# Altium schematic sheet CPU.3.SchDoc
size C
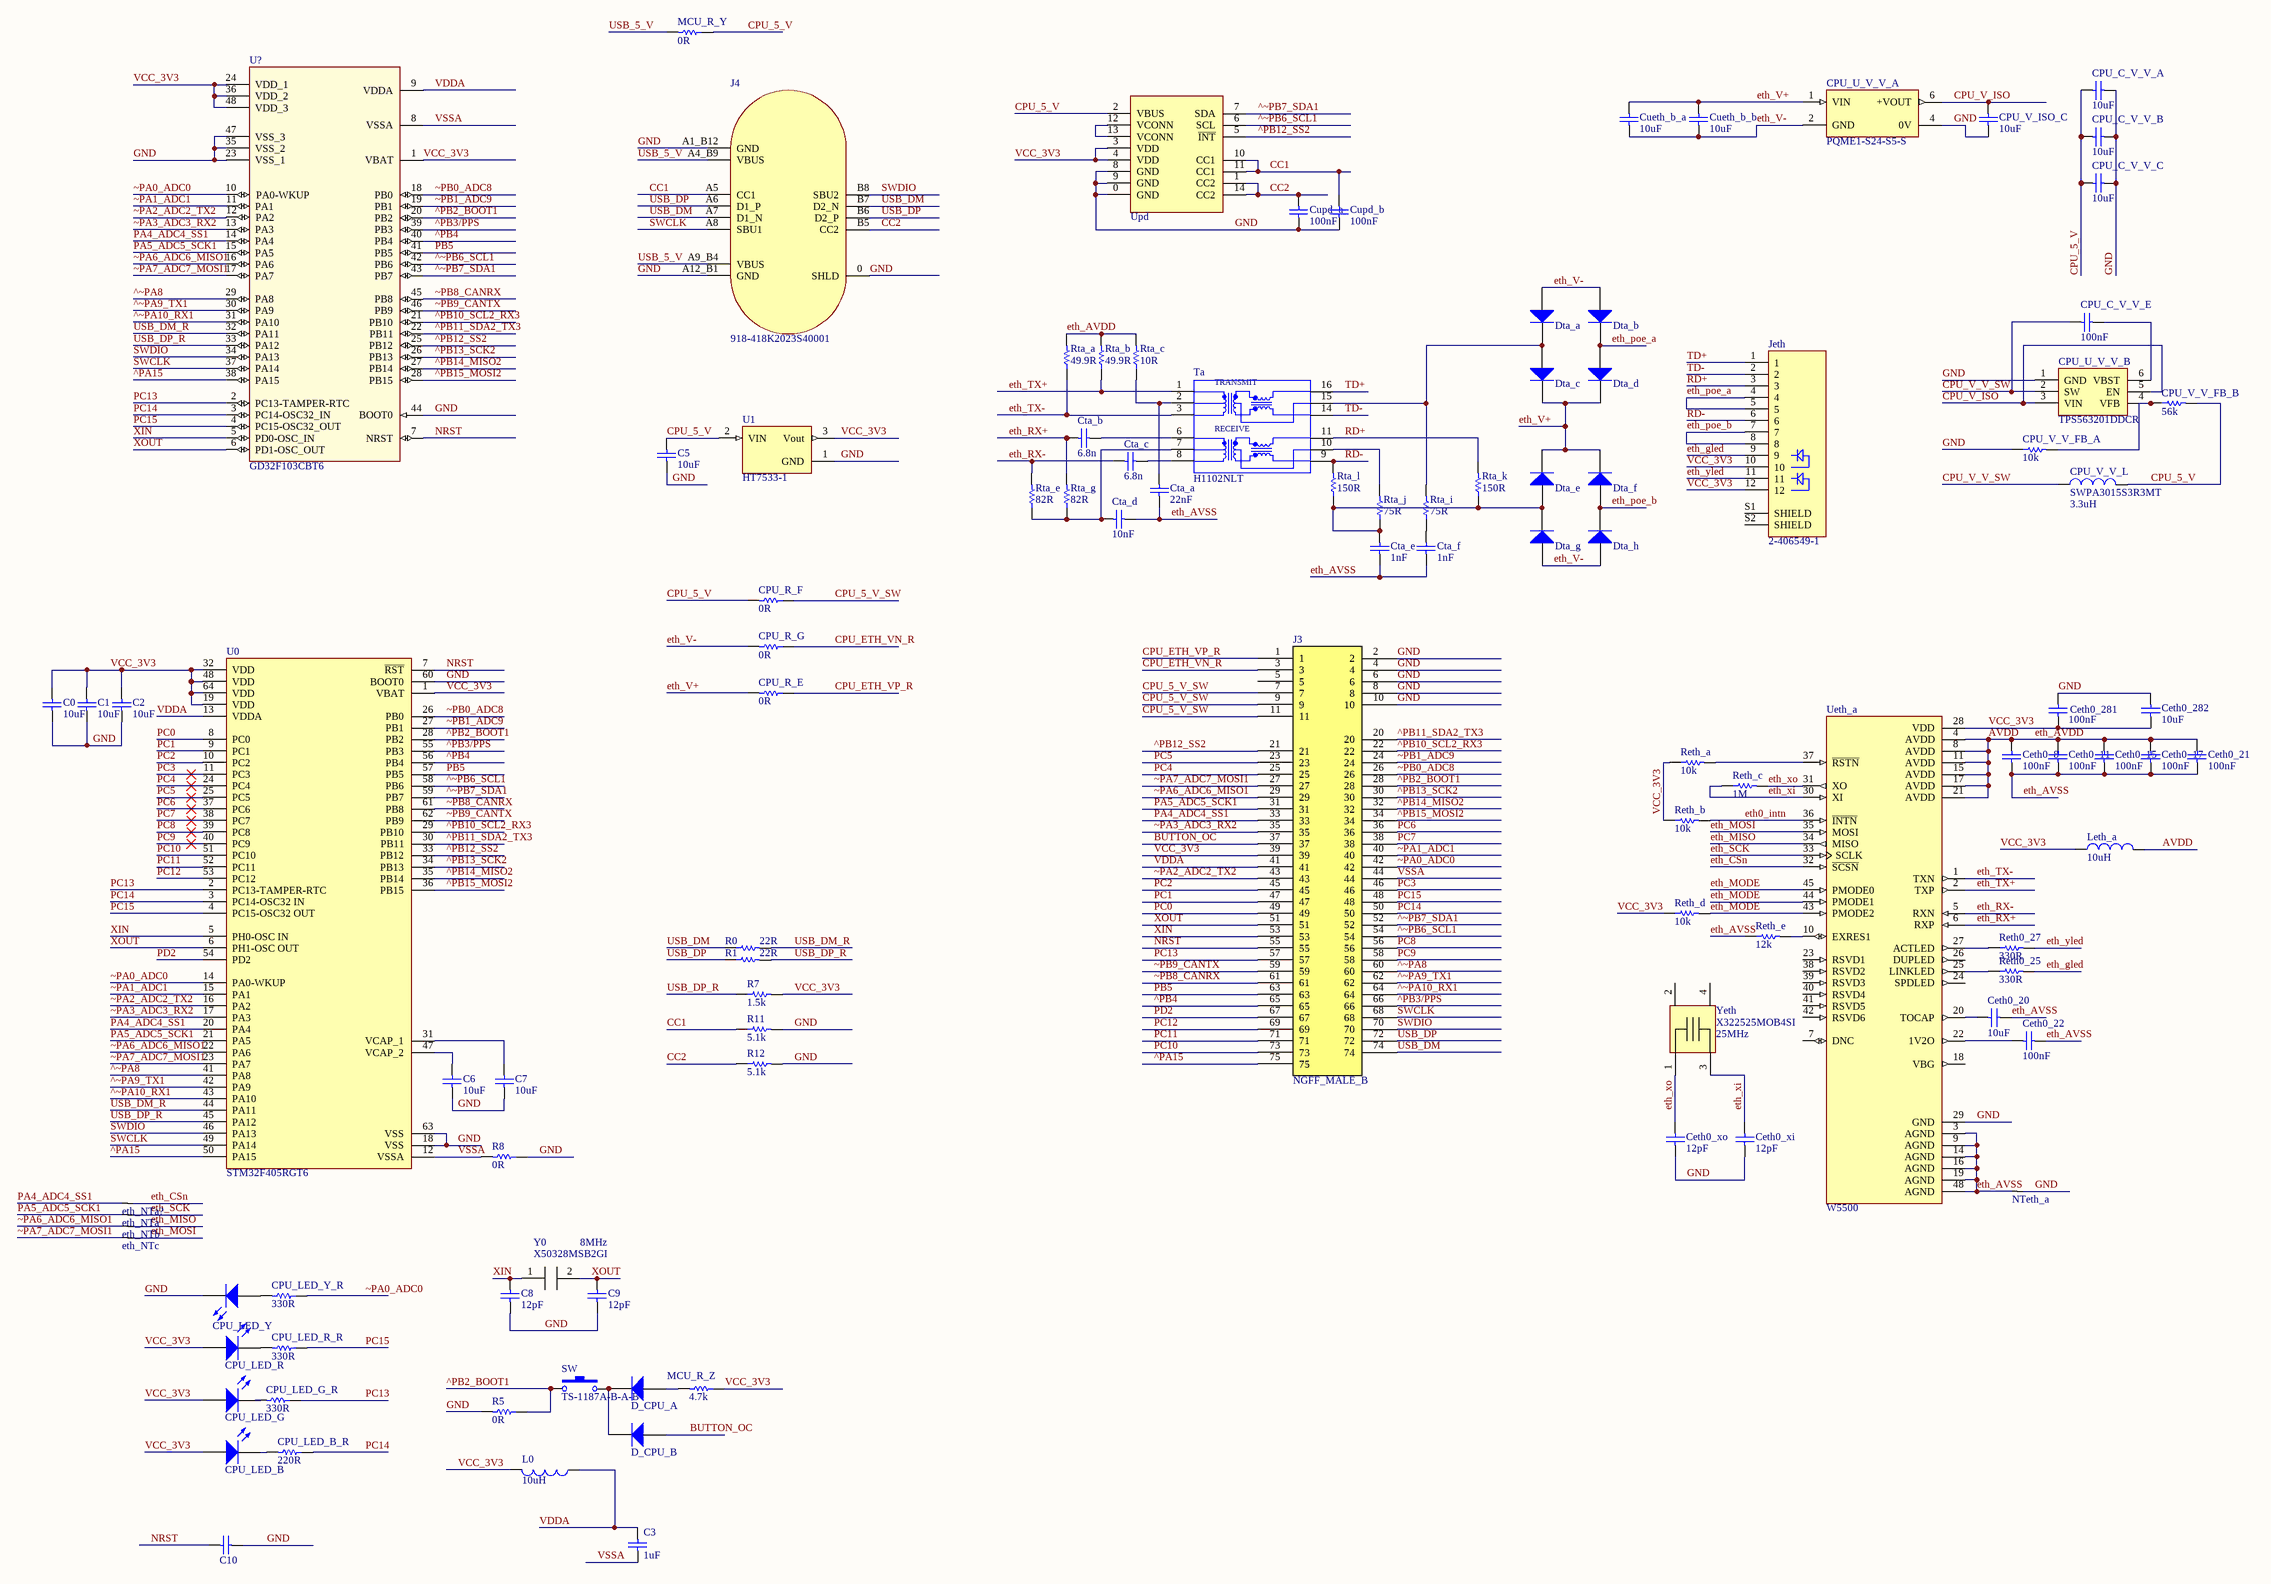
[diagram p0: CPU.3.SchDoc]

## Parts
C0  value 10uF  [C_0402]  (hidden comment: CL05A106MQ5NUNC)
C1  value 10uF  [C_0402]  (hidden comment: CL05A106MQ5NUNC)
C2  value 10uF  [C_0402]  (hidden comment: CL05A106MQ5NUNC)
C3  value 1uF  [C_0402]  (hidden comment: CL05A105KA5NQNC)
C5  value 10uF  [C_0805]  (hidden comment: CL21A106KAYNNNE)
C6  value 10uF  [C_0402]  (hidden comment: CL05A106MQ5NUNC)
C7  value 10uF  [C_0402]  (hidden comment: CL05A106MQ5NUNC)
C8  value 12pF  [C_0402]  (hidden comment: 0402CG120J500NT)
C9  value 12pF  [C_0402]  (hidden comment: 0402CG120J500NT)
C10  0402CG101J500NT  [C_0402]  (value not drawn)
Ceth0_8  value 100nF  [C_0402]  (hidden comment: CL05B104KO5NNNC)
Ceth0_11  value 100nF  [C_0402]  (hidden comment: CL05B104KO5NNNC)
Ceth0_15  value 100nF  [C_0402]  (hidden comment: CL05B104KO5NNNC)
Ceth0_17  value 100nF  [C_0402]  (hidden comment: CL05B104KO5NNNC)
Ceth0_20  value 10uF  [C_0402]  (hidden comment: CL05A106MQ5NUNC)
Ceth0_21  value 100nF  [C_0402]  (hidden comment: CL05B104KO5NNNC)
Ceth0_22  value 100nF  [C_0402]  (hidden comment: CL05B104KO5NNNC)
Ceth0_281  value 100nF  [C_0402]  (hidden comment: CL05B104KO5NNNC)
Ceth0_282  value 10uF  [C_0402]  (hidden comment: CL05A106MQ5NUNC)
Ceth0_xi  value 12pF  [C_0402]  (hidden comment: 0402CG120J500NT)
Ceth0_xo  value 12pF  [C_0402]  (hidden comment: 0402CG120J500NT)
CPU_C_V_V_A  value 10uF  [C_0402]  (hidden comment: CL05A106MQ5NUNC)
CPU_C_V_V_B  value 10uF  [C_0402]  (hidden comment: CL05A106MQ5NUNC)
CPU_C_V_V_C  value 10uF  [C_0402]  (hidden comment: CL05A106MQ5NUNC)
CPU_C_V_V_E  value 100nF  [C_0402]  (hidden comment: CL05B104KO5NNNC)
CPU_LED_B  19-217/BHC-ZL1M2RY/3T  [D_0603]  (value not drawn)
CPU_LED_B_R  value 220R  [R_0402]  (hidden comment: 0402WGF2200TCE)
CPU_LED_G  19-217/GHC-YR1S2/3T  [D_0603]  (value not drawn)
CPU_LED_G_R  value 330R  [R_0402]  (hidden comment: 0402WGF3300TCE)
CPU_LED_R  KT-0603R  [D_0603]  (value not drawn)
CPU_LED_R_R  value 330R  [R_0402]  (hidden comment: 0402WGF3300TCE)
CPU_LED_Y  19-21UYC/S530-A4/TR8  [D_0603]  (value not drawn)
CPU_LED_Y_R  value 330R  [R_0402]  (hidden comment: 0402WGF3300TCE)
CPU_R_E  value 0R  [R_0402]  (hidden comment: 0402WGF0000TCE)
CPU_R_F  value 0R  [R_0402]  (hidden comment: 0402WGF0000TCE)
CPU_R_G  value 0R  [R_0402]  (hidden comment: 0402WGF0000TCE)
CPU_U_V_V_A  PQME1-S24-S5-S  [PQME1]
CPU_U_V_V_B  TPS563201DDCR  [SOT-23-6]
CPU_V_ISO_C  value 10uF  [C_0805]  (hidden comment: CL21A106KAYNNNE)
CPU_V_V_FB_A  value 10k  [R_0402]  (hidden comment: 0402WGF1002TCE)
CPU_V_V_FB_B  value 56k  [R_0402]  (hidden comment: 0402WGF5602TCE)
CPU_V_V_L  SWPA3015S3R3MT  value 3.3uH  [swpa301]
Cta_a  value 22nF  [C_0402]  (hidden comment: 0402B223K500NT)
Cta_b  value 6.8n  [C_0402]  (hidden comment: 0402B682K500NT)
Cta_c  value 6.8n  [C_0402]  (hidden comment: 0402B682K500NT)
Cta_d  value 10nF  [C_0402]  (hidden comment: CL05B103KB5NNNC)
Cta_e  value 1nF  [C_1206]  (hidden comment: 1206B102K202NT)
Cta_f  value 1nF  [C_1206]  (hidden comment: 1206B102K202NT)
Cueth_b_a  value 10uF  [C_0805]  (hidden comment: CL21A106KAYNNNE)
Cueth_b_b  value 10uF  [C_0805]  (hidden comment: CL21A106KAYNNNE)
Cupd_a  value 100nF  [C_0402]  (hidden comment: CL05B104KO5NNNC)
Cupd_b  value 100nF  [C_0402]  (hidden comment: CL05B104KO5NNNC)
D_CPU_A  1N4148WS  [SOD-323]  (value not drawn)
D_CPU_B  1N4148WS  [SOD-323]  (value not drawn)
Dta_a  1N4148WS  [SOD-323]  (value not drawn)
Dta_b  1N4148WS  [SOD-323]  (value not drawn)
Dta_c  1N4148WS  [SOD-323]  (value not drawn)
Dta_d  1N4148WS  [SOD-323]  (value not drawn)
Dta_e  1N4148WS  [SOD-323]  (value not drawn)
Dta_f  1N4148WS  [SOD-323]  (value not drawn)
Dta_g  1N4148WS  [SOD-323]  (value not drawn)
Dta_h  1N4148WS  [SOD-323]  (value not drawn)
eth_NTa  0  [NET_TIE]  (value not drawn)
eth_NTa?  0  [NET_TIE]  (value not drawn)
eth_NTb  0  [NET_TIE]  (value not drawn)
eth_NTc  0  [NET_TIE]  (value not drawn)
J3  NGFF_MALE_B  [NGFF_MALE_B]
J4  918-418K2023S40001  [DX07S016JA1R1500]
Jeth  2-406549-1  [TE_2-406549-1]
L0  value 10uH  [L_0603]  (hidden comment: SDFL1608S100KTF)
Leth_a  value 10uH  [L_0603]  (hidden comment: SDFL1608S100KTF)
MCU_R_Y  value 0R  [R_0402]  (hidden comment: 0402WGF0000TCE)
MCU_R_Z  value 4.7k  [R_0402]  (hidden comment: 0402WGF4701TCE)
NTeth_a  0  [NET_TIE]  (value not drawn)
R0  value 22R  [R_0402]  (hidden comment: 0402WGF220JTCE)
R1  value 22R  [R_0402]  (hidden comment: 0402WGF220JTCE)
R5  value 0R  [R_0402]  (hidden comment: 0402WGF0000TCE)
R7  value 1.5k  [R_0402]  (hidden comment: 0402WGF1501TCE)
R8  value 0R  [R_0402]  (hidden comment: 0402WGF0000TCE)
R11  value 5.1k  [R_0402]  (hidden comment: 0402WGF5101TCE)
R12  value 5.1k  [R_0402]  (hidden comment: 0402WGF5101TCE)
Reth0_25  value 330R  [R_0402]  (hidden comment: 0402WGF3300TCE)
Reth0_27  value 330R  [R_0402]  (hidden comment: 0402WGF3300TCE)
Reth_a  value 10k  [R_0402]  (hidden comment: 0402WGF1002TCE)
Reth_b  value 10k  [R_0402]  (hidden comment: 0402WGF1002TCE)
Reth_c  value 1M  [R_0402]  (hidden comment: 0402WGF1004TCE)
Reth_d  value 10k  [R_0402]  (hidden comment: 0402WGF1002TCE)
Reth_e  value 12k  [R_0402]  (hidden comment: 0402WGF1202TCE)
Rta_a  value 49.9R  [R_0402]  (hidden comment: 0402WGF499JTCE)
Rta_b  value 49.9R  [R_0402]  (hidden comment: 0402WGF499JTCE)
Rta_c  value 10R  [R_0402]  (hidden comment: 0402WGF100JTCE)
Rta_e  value 82R  [R_0603]  (hidden comment: 0603WAF820JT5E)
Rta_g  value 82R  [R_0603]  (hidden comment: 0603WAF820JT5E)
Rta_i  value 75R  [R_0402]  (hidden comment: 0402WGF750JTCE)
Rta_j  value 75R  [R_0402]  (hidden comment: 0402WGF750JTCE)
Rta_k  value 150R  [R_0402]  (hidden comment: 0402WGF1500TCE)
Rta_l  value 150R  [R_0402]  (hidden comment: 0402WGF1500TCE)
SW  TS-1187A-B-A-B  [TS-1187A-C-C-B]
Ta  H1102NLT  [XFMR_H1102NLT]
U0  STM32F405RGT6  [QFP-64-P0.5MM]
U1  HT7533-1  [SOT-223-3]
U?  GD32F103CBT6  [QFP-48-P0.5MM]
Ueth_a  W5500  [QFP-48-P0.5MM]
Upd  FUSB302BMPX  [QFN-14-P0.5MM]  (value not drawn)
Y0  X50328MSB2GI  value 8MHz  [YSX530GA]
Yeth  X322525MOB4SI  value 25MHz  [X322512MSB4SI]

## Nets
^PA15: J3.75 U0.50(PA15) U?.38(PA15)
^PB2_BOOT1: J3.28 R5.1 SW.1 U0.28(PB2) U?.20(PB2)
^PB3/PPS: J3.66 U0.55(PB3) U?.39(PB3)
^PB4: J3.65 U0.56(PB4) U?.40(PB4)
^PB10_SCL2_RX3: J3.22 U0.29(PB10) U?.21(PB10)
^PB11_SDA2_TX3: J3.20 U0.30(PB11) U?.22(PB11)
^PB12_SS2: J3.21 U0.33(PB12) U?.25(PB12) Upd.5(~{INT})
^PB13_SCK2: J3.30 U0.34(PB13) U?.26(PB13)
^PB14_MISO2: J3.32 U0.35(PB14) U?.27(PB14)
^PB15_MOSI2: J3.34 U0.36(PB15) U?.28(PB15)
^~PA8: J3.60 U0.41(PA8) U?.29(PA8)
^~PA9_TX1: J3.62 U0.42(PA9) U?.30(PA9)
^~PA10_RX1: J3.64 U0.43(PA10) U?.31(PA10)
^~PB6_SCL1: J3.54 U0.58(PB6) U?.42(PB6) Upd.6(SCL)
^~PB7_SDA1: J3.52 U0.59(PB7) U?.43(PB7) Upd.7(SDA)
AVDD: Ceth0_8.2 Ceth0_11.2 Ceth0_15.2 Ceth0_17.2 Ceth0_21.2 Leth_a.2 Rta_a.2 Rta_b.2 Rta_c.2 Ueth_a.4(AVDD) Ueth_a.8(AVDD) Ueth_a.11(AVDD) Ueth_a.15(AVDD) Ueth_a.17(AVDD) Ueth_a.21(AVDD)  [also labelled eth_AVDD]
BUTTON_OC: D_CPU_B.2(A) J3.37
CC1: Cupd_b.1 J4.A5(CC1) R11.1 Upd.10(CC1) Upd.11(CC1)
CC2: Cupd_a.1 J4.B5(CC2) R12.1 Upd.1(CC2) Upd.14(CC2)
CPU_5_V: C5.2 CPU_C_V_V_A.1 CPU_C_V_V_B.1 CPU_C_V_V_C.1 CPU_R_F.2 CPU_V_V_FB_B.2 CPU_V_V_L.2 MCU_R_Y.1 U1.2(VIN) Upd.2(VBUS)
CPU_5_V_SW: CPU_R_F.1 J3.7 J3.9 J3.11
CPU_ETH_VN_R: CPU_R_G.1 J3.3
CPU_ETH_VP_R: CPU_R_E.1 J3.1
CPU_V_ISO: CPU_U_V_V_A.6(+VOUT) CPU_U_V_V_B.3(VIN) CPU_U_V_V_B.5(EN) CPU_V_ISO_C.2
CPU_V_V_SW: CPU_C_V_V_E.1 CPU_U_V_V_B.2(SW) CPU_V_V_L.1
eth0_intn: Reth_b.2 Ueth_a.36(~{INTN})
eth_AVSS: Ceth0_8.1 Ceth0_11.1 Ceth0_15.1 Ceth0_17.1 Ceth0_20.2 Ceth0_21.1 Ceth0_22.1 Cta_a.1 Cta_d.2 Cta_e.1 Cta_f.1 NTeth_a.1 Reth_e.1 Ueth_a.3(AGND) Ueth_a.9(AGND) Ueth_a.14(AGND) Ueth_a.16(AGND) Ueth_a.19(AGND) Ueth_a.48(AGND)
eth_CSn: eth_NTa?.2 Ueth_a.32(~{SCSN})
eth_gled: Jeth.9 Reth0_25.2
eth_MISO: eth_NTb.2 Ueth_a.34(MISO)
eth_MODE: Reth_d.2 Ueth_a.43(PMODE2) Ueth_a.44(PMODE1) Ueth_a.45(PMODE0)
eth_MOSI: eth_NTc.2 Ueth_a.35(MOSI)
eth_poe_a: Dta_b.1(K) Dta_d.2(A) Jeth.4 Jeth.5
eth_poe_b: Dta_f.2(A) Dta_h.1(K) Jeth.7 Jeth.8
eth_RX+: Cta_b.1 Rta_g.2 Ueth_a.6(RXP)
eth_RX-: Cta_c.1 Rta_e.2 Ueth_a.5(RXN)
eth_SCK: eth_NTa.2 Ueth_a.33(SCLK)
eth_TX+: Rta_b.1 Ta.1 Ueth_a.2(TXP)
eth_TX-: Rta_a.1 Ta.3 Ueth_a.1(TXN)
eth_V+: CPU_R_E.2 CPU_U_V_V_A.1(VIN) Cueth_b_a.2 Cueth_b_b.2 Dta_c.1(K) Dta_d.1(K) Dta_e.1(K) Dta_f.1(K)
eth_V-: CPU_R_G.2 CPU_U_V_V_A.2(GND) Cueth_b_a.1 Cueth_b_b.1 Dta_a.2(A) Dta_b.2(A) Dta_g.2(A) Dta_h.2(A)
eth_xi: Ceth0_xi.2 Reth_c.1 Ueth_a.30(XI) Yeth.3
eth_xo: Ceth0_xo.2 Reth_c.2 Ueth_a.31(XO) Yeth.1
eth_yled: Jeth.11 Reth0_27.2
GND: C0.1 C1.1 C2.1 C5.1 C6.1 C7.1 C8.1 C9.1 C10.1 Ceth0_281.1 Ceth0_282.2 Ceth0_xi.1 Ceth0_xo.1 CPU_C_V_V_A.2 CPU_C_V_V_B.2 CPU_C_V_V_C.2 CPU_LED_Y.1(K) CPU_U_V_V_A.4(0V) CPU_U_V_V_B.1(GND) CPU_V_ISO_C.1 CPU_V_V_FB_A.1 Cupd_a.2 Cupd_b.2 J3.2 J3.4 J3.6 J3.8 J3.10 J4.0(SHLD) J4.A1_B12(GND) J4.A12_B1(GND) NTeth_a.2 R5.2 R8.1 R11.2 R12.2 U0.18(VSS) U0.60(BOOT0) U0.63(VSS) U1.1(GND) U?.23(VSS_1) U?.35(VSS_2) U?.44(BOOT0) U?.47(VSS_3) Ueth_a.29(GND) Upd.0(GND) Upd.8(GND) Upd.9(GND)
NRST: C10.2 J3.55 U0.7(~{RST}) U?.7(NRST)
PA4_ADC4_SS1: eth_NTa?.1 J3.33 U0.20(PA4) U?.14(PA4)
PA5_ADC5_SCK1: eth_NTa.1 J3.31 U0.21(PA5) U?.15(PA5)
PB5: J3.63 U0.57(PB5) U?.41(PB5)
PC0: J3.49 U0.8(PC0)
PC1: J3.47 U0.9(PC1)
PC2: J3.45 U0.10(PC2)
PC3: J3.46 U0.11(PC3)
PC4: J3.25 U0.24(PC4)
PC5: J3.23 U0.25(PC5)
PC6: J3.36 U0.37(PC6)
PC7: J3.38 U0.38(PC7)
PC8: J3.56 U0.39(PC8)
PC9: J3.58 U0.40(PC9)
PC10: J3.73 U0.51(PC10)
PC11: J3.71 U0.52(PC11)
PC12: J3.69 U0.53(PC12)
PC13: CPU_LED_G_R.1 J3.57 U0.2(PC13-TAMPER-RTC) U?.2(PC13-TAMPER-RTC)
PC14: CPU_LED_B_R.1 J3.50 U0.3(PC14-OSC32_IN) U?.3(PC14-OSC32_IN)
PC15: CPU_LED_R_R.1 J3.48 U0.4(PC15-OSC32_OUT) U?.4(PC15-OSC32_OUT)
PD2: J3.67 U0.54(PD2)
RD+: Jeth.3 Rta_k.2 Ta.11
RD-: Jeth.6 Rta_l.2 Ta.9
SWCLK: J3.68 J4.A8(SBU1) U0.49(PA14) U?.37(PA14)
SWDIO: J3.70 J4.B8(SBU2) U0.46(PA13) U?.34(PA13)
TD+: Jeth.1 Ta.16
TD-: Jeth.2 Ta.14
USB_5_V: J4.A4_B9(VBUS) J4.A9_B4(VBUS) MCU_R_Y.2
USB_DM: J3.74 J4.A7(D1_N) J4.B7(D2_N) R0.1
USB_DM_R: R0.2 U0.44(PA11) U?.32(PA11)
USB_DP: J3.72 J4.A6(D1_P) J4.B6(D2_P) R1.1
USB_DP_R: R1.2 R7.1 U0.45(PA12) U?.33(PA12)
VCC_3V3: C0.2 C1.2 C2.2 Ceth0_281.2 Ceth0_282.1 CPU_LED_B.2(A) CPU_LED_G.2(A) CPU_LED_R.2(A) J3.39 Jeth.10 Jeth.12 L0.2 Leth_a.1 MCU_R_Z.1 R7.2 Reth_a.1 Reth_b.1 Reth_d.1 U0.1(VBAT) U0.19(VDD) U0.32(VDD) U0.48(VDD) U0.64(VDD) U1.3(Vout) U?.1(VBAT) U?.24(VDD_1) U?.36(VDD_2) U?.48(VDD_3) Ueth_a.28(VDD) Upd.3(VDD) Upd.4(VDD)
VDDA: C3.2 J3.41 L0.1 U0.13(VDDA) U?.9(VDDA)
VSSA: C3.1 J3.44 R8.2 U0.12(VSSA) U?.8(VSSA)
XIN: C8.2 J3.53 U0.5(PH0-OSC_IN) U?.5(PD0-OSC_IN) Y0.1
XOUT: C9.2 J3.51 U0.6(PH1-OSC_OUT) U?.6(PD1-OSC_OUT) Y0.2
~PA0_ADC0: CPU_LED_Y_R.1 J3.42 U0.14(PA0-WKUP) U?.10(PA0-WKUP)
~PA1_ADC1: J3.40 U0.15(PA1) U?.11(PA1)
~PA2_ADC2_TX2: J3.43 U0.16(PA2) U?.12(PA2)
~PA3_ADC3_RX2: J3.35 U0.17(PA3) U?.13(PA3)
~PA6_ADC6_MISO1: eth_NTb.1 J3.29 U0.22(PA6) U?.16(PA6)
~PA7_ADC7_MOSI1: eth_NTc.1 J3.27 U0.23(PA7) U?.17(PA7)
~PB0_ADC8: J3.26 U0.26(PB0) U?.18(PB0)
~PB1_ADC9: J3.24 U0.27(PB1) U?.19(PB1)
~PB8_CANRX: J3.61 U0.61(PB8) U?.45(PB8)
~PB9_CANTX: J3.59 U0.62(PB9) U?.46(PB9)
NetC6_2: C6.2 U0.47(VCAP_2)
NetC7_2: C7.2 U0.31(VCAP_1)
NetCeth0_20_1: Ceth0_20.1 Ueth_a.20(TOCAP)
NetCeth0_22_2: Ceth0_22.2 Ueth_a.22(1V2O)
NetCPU_C_V_V_E_2: CPU_C_V_V_E.2 CPU_U_V_V_B.6(VBST)
NetCPU_LED_B_1: CPU_LED_B.1(K) CPU_LED_B_R.2
NetCPU_LED_G_1: CPU_LED_G.1(K) CPU_LED_G_R.2
NetCPU_LED_R_1: CPU_LED_R.1(K) CPU_LED_R_R.2
NetCPU_LED_Y_2: CPU_LED_Y.2(A) CPU_LED_Y_R.2
NetCPU_U_V_V_B_4: CPU_U_V_V_B.4(VFB) CPU_V_V_FB_A.2 CPU_V_V_FB_B.1
NetCta_a_2: Cta_a.2 Rta_c.1 Ta.2
NetCta_b_2: Cta_b.2 Ta.6
NetCta_c_2: Cta_c.2 Ta.8
NetCta_d_1: Cta_d.1 Rta_e.1 Rta_g.1 Ta.7
NetCta_e_2: Cta_e.2 Dta_e.2(A) Dta_g.1(K) Rta_j.1 Rta_k.1 Rta_l.1
NetCta_f_2: Cta_f.2 Rta_i.1
NetD_CPU_A_1: D_CPU_A.1(K) D_CPU_B.1(K) SW.2
NetD_CPU_A_2: D_CPU_A.2(A) MCU_R_Z.2
NetDta_a_1: Dta_a.1(K) Dta_c.2(A) Rta_i.2 Ta.15
NetReth0_25_1: Reth0_25.1 Ueth_a.25(LINKLED)
NetReth0_27_1: Reth0_27.1 Ueth_a.27(ACTLED)
NetReth_a_2: Reth_a.2 Ueth_a.37(~{RSTN})
NetReth_e_2: Reth_e.2 Ueth_a.10(EXRES1)
NetRta_j_2: Rta_j.2 Ta.10
NetUpd_12: Upd.12(VCONN) Upd.13(VCONN)

Not connected (* = marked no-connect by the designer): J3 5; Jeth S1(SHIELD) S2(SHIELD); Ueth_a 7(DNC) 18(VBG) 23(RSVD1) 24(SPDLED) 26(DUPLED) 38(RSVD2) 39(RSVD3) 40(RSVD4) 41(RSVD5) 42(RSVD6); Yeth 2(GND) 4(GND)

## Notes on the sheet
- (in symbol H1102NLT) TRANSMIT; RECEIVE

## Library data of the parts
C0-C2 C6 C7 Ceth0_20 Ceth0_282 CPU_C_V_V_A CPU_C_V_V_B CPU_C_V_V_C = CL05A106MQ5NUNC: C - CAPACITOR - MLCC - 10uF - 6.3V - 0402; WVDC: 6.3; LCSC Part #: C15525; JLC Availability: Basic
C3 = CL05A105KA5NQNC: C - CAPACITOR - MLCC - 1uF - 25V - 0402; WVDC: 16; LCSC Part #: C52923; JLC Availability: Basic
C5 CPU_V_ISO_C Cueth_b_a Cueth_b_b = CL21A106KAYNNNE: C - CAPACITOR - MLCC - 10uF - 25V - 0805; WVDC: 25; LCSC Part #: C15850; Availability: Basic
C8 C9 Ceth0_xi Ceth0_xo = 0402CG120J500NT: C - CAPACITOR - MLCC - 12pF - 50V - 0402; WVDC: 50; LCSC Part #: C1547; JLC Availability: Basic
C10 = 0402CG101J500NT: C - CAPACITOR - MLCC - 100pF - 50V - 0402; LCSC Part #: C1546; JLC Availability: Extended
Ceth0_8 Ceth0_11 Ceth0_15 Ceth0_17 Ceth0_21 Ceth0_22 Ceth0_281 CPU_C_V_V_E Cupd_a Cupd_b = CL05B104KO5NNNC: C - CAPACITOR - MLCC - 100nF - 16V - 0402; WVDC: 16; LCSC Part #: C1525; JLC Availability: Basic
CPU_LED_B = 19-217/BHC-ZL1M2RY/3T: D - LED - 0603 - Blue; LCSC Part #: C72041; JLC Availability: Basic
CPU_LED_B_R = 0402WGF2200TCE: R - RESISTOR - SMD - 220R - 1% - 0402; LCSC Part #: C25091; JLC Availability: Basic
CPU_LED_G = 19-217/GHC-YR1S2/3T: D - LED - 0603 - Green; LCSC Part #: C72043; JLC Availability: Basic
CPU_LED_G_R CPU_LED_R_R CPU_LED_Y_R Reth0_25 Reth0_27 = 0402WGF3300TCE: R - RESISTOR - SMD - 330R - 1% - 0402; LCSC Part #: C25104; JLC Availability: Basic
CPU_LED_R = KT-0603R: D - LED - 0603 - Red; LCSC Part #: C2286; JLC Availability: Basic
CPU_LED_Y = 19-21UYC/S530-A4/TR8: D - LED - 0603 - Yellow (Sodium); LCSC Part #: C409441; JLC Availability: Extended
CPU_R_E CPU_R_F CPU_R_G MCU_R_Y R5 R8 = 0402WGF0000TCE: R - RESISTOR - SMD - 0R - 1% - 0402; LCSC Part #: C17168; JLC Availability: Basic
CPU_U_V_V_A = PQME1-S24-S5-S: U - IC - 1 W, 1:1 Input Range, Single/Dual Unregulated Output, SIP, 24VDC IN, 3000 Vdc Isolation, Dc-Dc Converter; Value: 5VDC; MF: CUI Inc.; Package: SIP; Purchase-URL: https://pricing.snapeda.com/search/part/PEME1-S5-S3-S/?ref=eda; MP: PQME1-S24-S5-S; LCSC Part #: N/A; Availability: None; SnapEDA_Link: https://www.snapeda.com/parts/PEME1-S5-S3-S/CUI/view-part/?ref=snap; CUI_purchase_URL: https://www.cui.com/product/dc-dc-converters/isolated/peme1-s-series?utm_source=snapeda.com&utm_medium=referral&utm_campaign=snapedaBOM
CPU_U_V_V_B = TPS563201DDCR: U - IC - ADJ Power Regulator; VOut: ADJ; LCSC Part #: C116592; JLC Availability: Extended
CPU_V_V_FB_A Reth_a Reth_b Reth_d = 0402WGF1002TCE: R - RESISTOR - SMD - 10k - 1% - 0402; LCSC Part #: C25744; JLC Availability: Basic
CPU_V_V_FB_B = 0402WGF5602TCE: R - RESISTOR - SMD - 56k - 1% - 0402; LCSC Part #: C25796; JLC Availability: Basic
CPU_V_V_L = SWPA3015S3R3MT: L - INDUCTOR - 3.3uH - 1.36A - 3mm; Isat: 1.36A; LCSC Part #: C48020; JLC Availability: Extended
Cta_a = 0402B223K500NT: C - CAPACITOR - MLCC - 22nF - 50V - 0402; WVDC: 50; LCSC Part #: C1532; JLC Availability: Basic
Cta_b Cta_c = 0402B682K500NT: C - CAPACITOR - MLCC - 6.8nF - 50V - 0402; WVDC: 50; LCSC Part #: C1542; JLC Availability: Basic
Cta_d = CL05B103KB5NNNC: C - CAPACITOR - MLCC - 10nF - 50V - 0402; WVDC: 50; LCSC Part #: C15195; JLC Availability: Basic
Cta_e Cta_f = 1206B102K202NT: C - CAPACITOR - MLCC - 1nF - 2000V - 1206 - X7R; WVDC: 2000; LCSC Part #: C9196; JLC Availability: Basic
D_CPU_A D_CPU_B Dta_a Dta_b Dta_c Dta_d Dta_e Dta_f Dta_g Dta_h = 1N4148WS: D - DIODE - FAST TRR - 100V - 150mA - 4ns; LCSC Part #: C2128; JLC Availability: Basic; PIV: 100V; If: 150mA; Trr: 4ns
eth_NTa eth_NTa? eth_NTb eth_NTc NTeth_a = NET_TIE: R - Net Tie
J3 = NGFF_MALE_B: NGFF Male Finger, B Key; Manufacturer: Kyocera; Manufacturer P/N: 245863050024829
J4 = 918-418K2023S40001: J - JACK - USB - Type C - Recepticle - SMT - 90°; JLC Availability: LCSC; LCSC Part #: C167321
Jeth = 2-406549-1: J - JACK - ETHERNET - Right - THT; LCSC Part #: C125068; JLC Availability: Extended
L0 Leth_a = SDFL1608S100KTF: L - INDUCTOR - 10uH - 0603; LCSC Part #: C1035; JLC Availability: Basic
MCU_R_Z = 0402WGF4701TCE: R - RESISTOR - SMD - 4.7k - 1% - 0402; LCSC Part #: C25900; JLC Availability: Basic
R0 R1 = 0402WGF220JTCE: R - RESISTOR - SMD - 22R - 1% - 0402; LCSC Part #: C25092; JLC Availability: Basic
R7 = 0402WGF1501TCE: R - RESISTOR - SMD - 1.5k - 1% - 0402; LCSC Part #: C25867; JLC Availability: Basic
R11 R12 = 0402WGF5101TCE: R - RESISTOR - SMD - 5.1k - 1% - 0402; LCSC Part #: C25905; JLC Availability: Basic
Reth_c = 0402WGF1004TCE: R - RESISTOR - SMD - 1M - 1% - 0402; LCSC Part #: C26083; JLC Availability: Basic
Reth_e = 0402WGF1202TCE: R - RESISTOR - SMD - 12k - 1% - 0402; LCSC Part #: C25752; JLC Availability: Basic
Rta_a Rta_b = 0402WGF499JTCE: R - RESISTOR - SMD - 49.9R - 1% - 0402; LCSC Part #: C25120; JLC Availability: Basic
Rta_c = 0402WGF100JTCE: R - RESISTOR - SMD - 10R - 1% - 0402; LCSC Part #: C25077; JLC Availability: Basic
Rta_e Rta_g = 0603WAF820JT5E: R - RESISTOR - SMD - 82R - 1% - 0603; LCSC Part #: C23255; JLC Availability: Basic
Rta_i Rta_j = 0402WGF750JTCE: R - RESISTOR - SMD - 75R - 1% - 0402; LCSC Part #: C25133; JLC Availability: Basic
Rta_k Rta_l = 0402WGF1500TCE: R - RESISTOR - SMD - 150R - 1% - 0402; LCSC Part #: C25082; JLC Availability: Basic
SW = TS-1187A-B-A-B: SW - SWITCH - SPST - NO - Top Actuated Surface Mount; LCSC Part #: C318884; JLC Availability: Basic
Ta = H1102NLT: T - Transfrormer - Isolation and Data Interface _Encapsulated_ Pulse Transformer 1:1 Transmitter, 1:1 Receiver Surface Mount; MF: Pulse Electronics; Package: SOIC-16 Pulse; Value: *; LCSC Part #: C18584; MP: H1102NL; SnapEDA_Link: https://www.snapeda.com/parts/H1102NL/Pulse%20Electronics%20Network/view-part/78695/?ref=snap; Availability: Extended
U0 = STM32F405RGT6: U - IC - MCU 32BIT 1MB FLASH 64LQFP; ComponentLink2Description: Datasheet; ComponentLink1URL: https://upverter.com/upn/revision/179c87d5c3d4f257/; ComponentLink1Description: Upverter; ComponentLink2URL: http://www.st.com/content/ccc/resource/technical/document/datasheet/33/d4/6f/1d/df/0b/4c/6d/CD00161566.pdf/files/CD00161566.pdf/jcr:content/translations/en.CD00161566.pdf; LCSC Part #: C15742; JLC Availability: Extended
U1 = HT7533-1: U - IC - 3V3 Power Regulator; VOut: 3.3; LCSC Part #: C14289; JLC Availability: Basic
U? = GD32F103CBT6: U - IC - MCU, 128 KB Flash, 20 KB Internal RAM, 37 I/Os, 48-pin LQFP, -40 to 85 degC; FLASH Size (Prog) (kB): 128; I/Os (High Current): 37; Internal RAM Size (kB): 20; Operating Frequency(F) (Processor speed) (MHz): 72; ComponentLink1Description: Manufacturer URL; ComponentLink1URL: http://www.st.com/web/en/home.html; ComponentLink2Description: Datasheet; ComponentLink2URL: http://www.st.com/st-web-ui/static/active/en/resource/technical/document/datasheet/CD00161566.pdf; ComponentLink3Description: Package Specification; ComponentLink3URL: http://www.st.com/st-web-ui/static/active/en/resource/technical/document/datasheet/DM00058181.pdf; LCSC Part #: C77979; JLC Availability: Extended
Ueth_a = W5500: U - IC - Ethernet Controller 10/100 Base-T/TX PHY SPI Interface 48-LQFP (7x7); MF: WIZnet; Value: *; Package: None; LCSC Part #: C32843; Price: None; MP: W5500; Availability: Extended; SnapEDA_Link: https://www.snapeda.com/parts/W5500/WIZnet/view-part/?ref=snap; Purchase-URL: https://pricing.snapeda.com/search/part/W5500/?ref=eda
Upd = FUSB302BMPX: U - IC - USB PD PHY; JLC Availability: Extended; LCSC Part #: C442699
Y0 = X50328MSB2GI: Y - RESONATOR - 8MHZ ±10PPM - SMD-5032; Availability: Basic; LCSC Part #: C115962
Yeth = X322525MOB4SI: Y - RESONATOR - 25MHZ ±10PPM; LCSC Part #: C9006; JLC Availability: Basic